# Altium schematic sheet Plata.SchDoc
size 420 x 297 mm; PageSetup: Record=PageOptions|CenterHorizontal=True|CenterVertical=True|PrintScale=0.47|XCorrection=1.00|YCorrection=1.00|PrintKind=1|BorderSize=5000000|LeftOffset=0|BottomOffset=0|Orientation=1|PaperLength=1000|PaperWidth=1000|Scale=100|PaperSource=7|PrintQuality=-4|MediaType=1|DitherType=10|PaperKind=A4|PrintScaleMode=1; MainDevice: Перв.примен.; Scale: 1:1; DocumentType: Схема электрическая принципиальная; FirstReferrence: АБВГ.123456.001
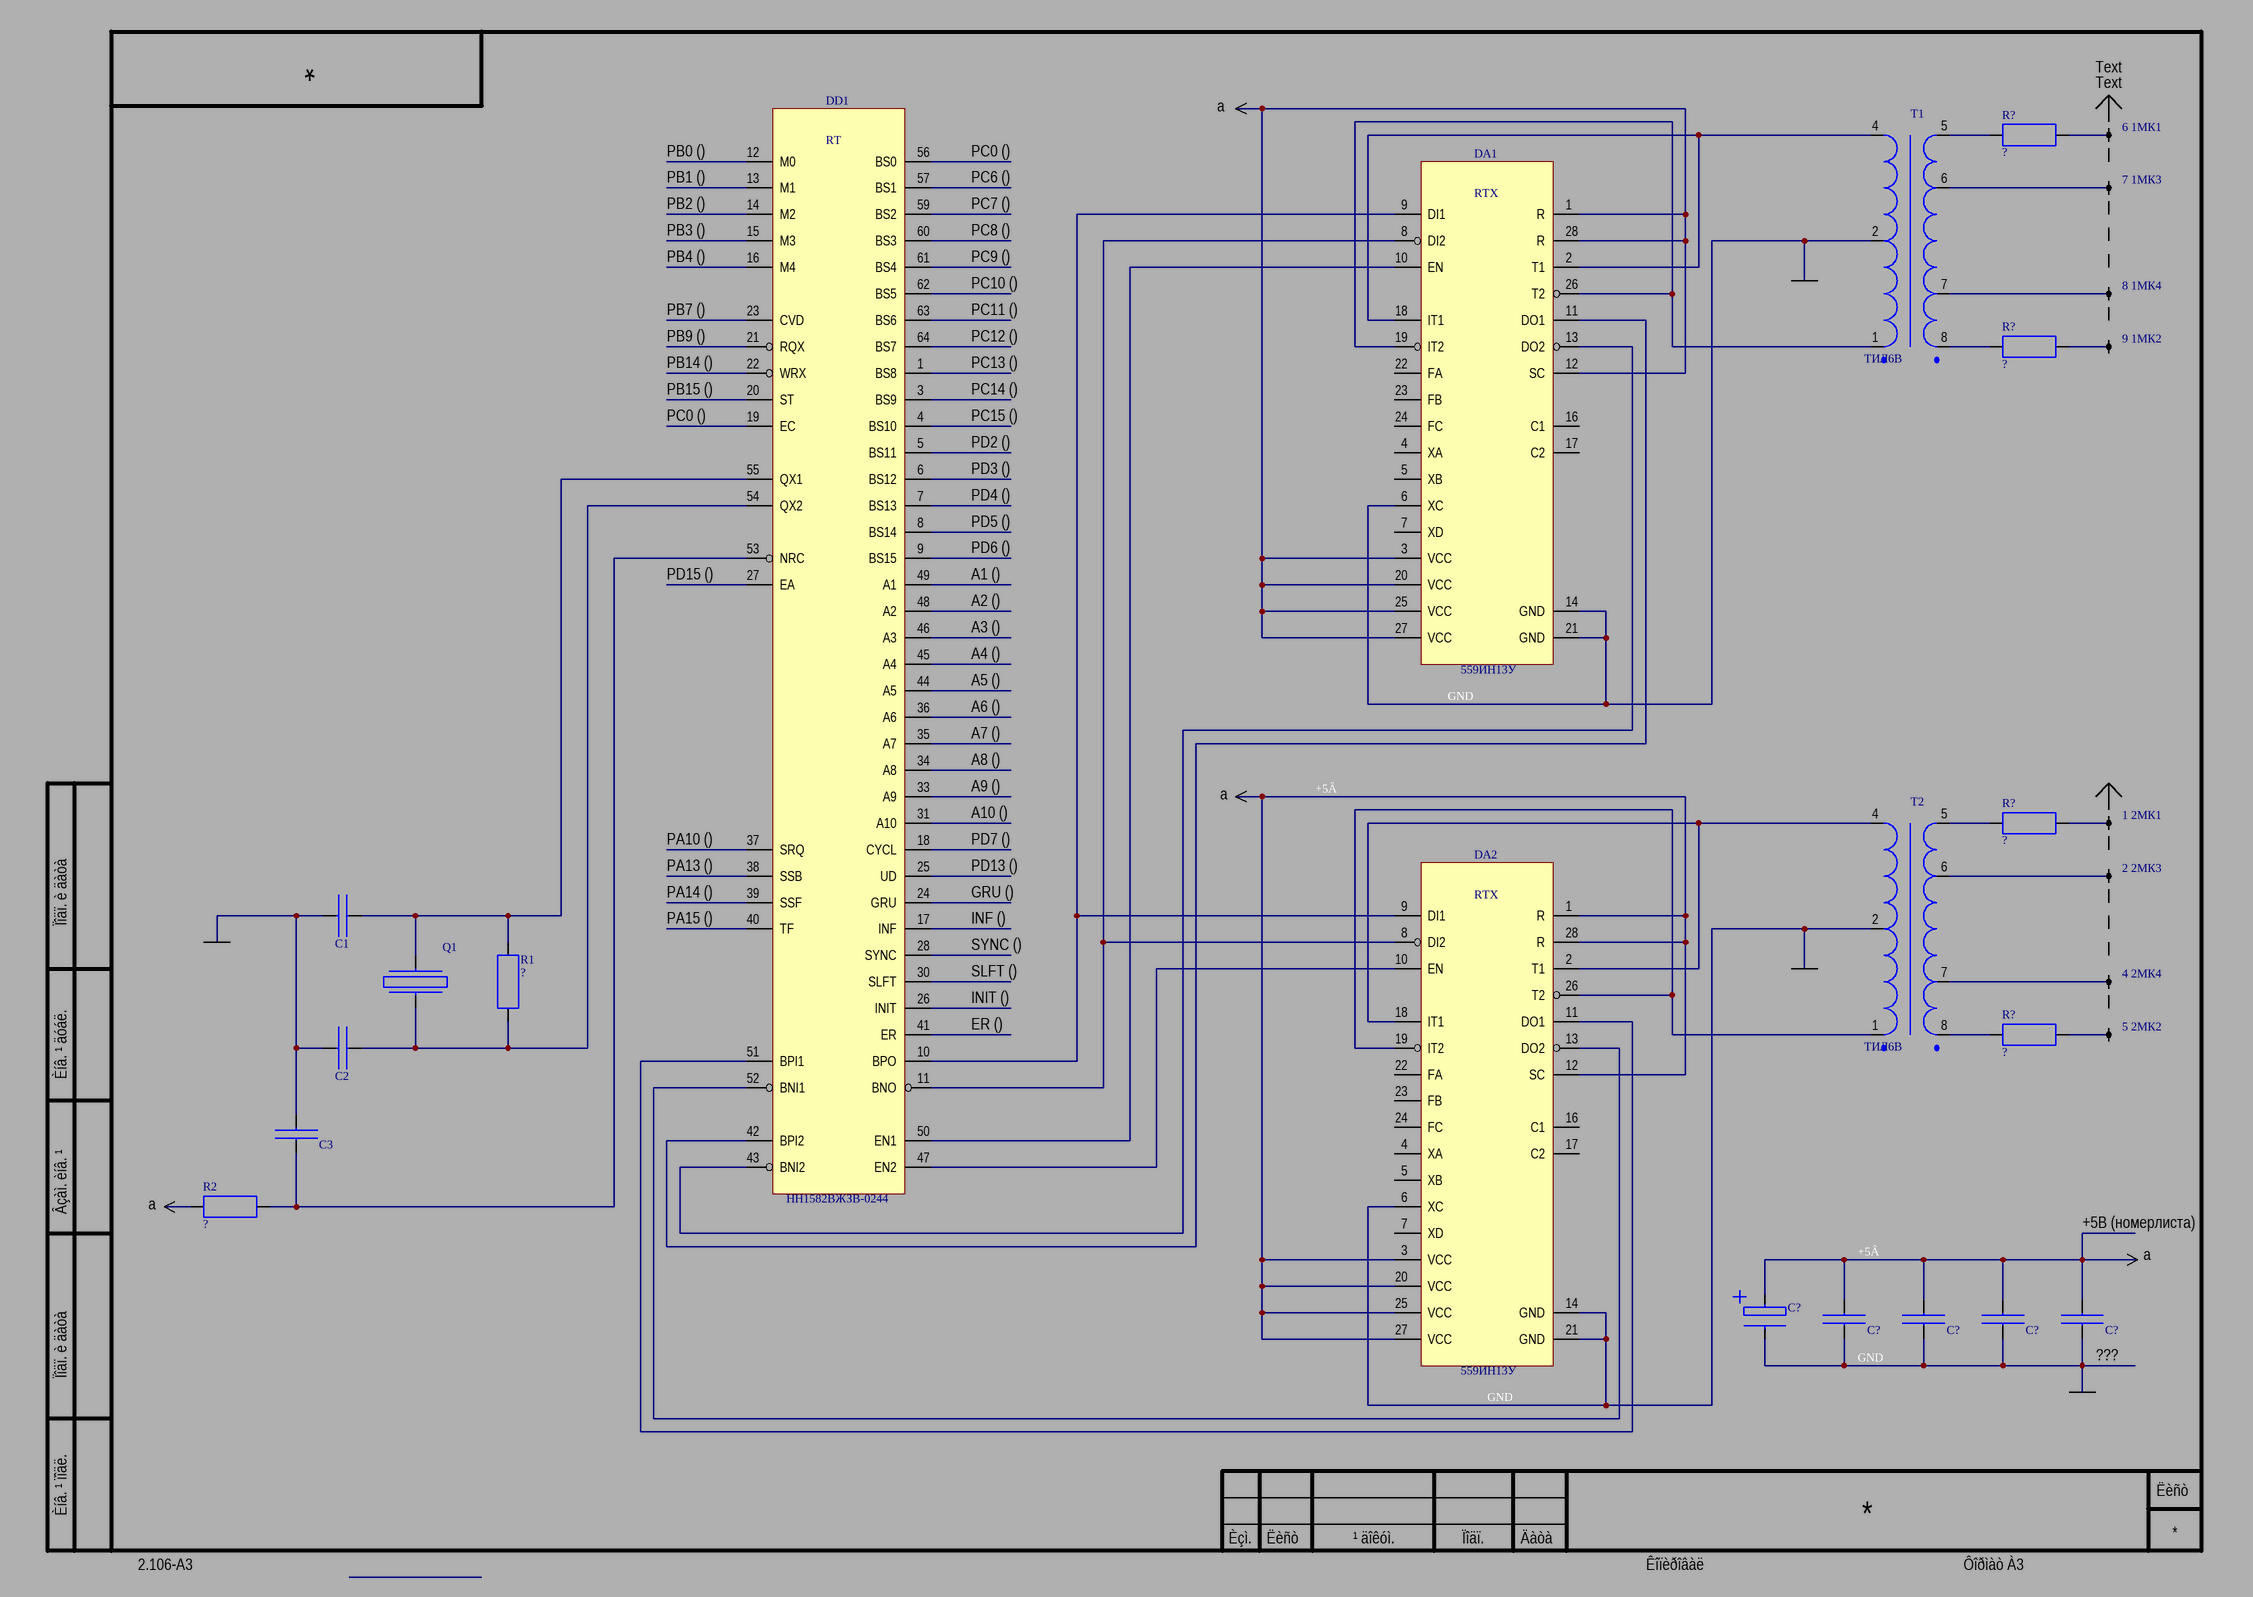
[diagram p0: Plata.SchDoc]

## Parts
(Parts that share a designator on the sheet are numbered #1, #2 ... from top to bottom, then left to right.)
C1  ?  [CAP0805]  (value not drawn)
C2  ?  [CAP0805]  (value not drawn)
C3  ?  [CAP0805]  (value not drawn)
C?#1  C_3  (value not drawn)
C?#2  ?  [CAP0805]  (value not drawn)
C?#3  ?  [CAP0805]  (value not drawn)
C?#4  ?  [CAP0805]  (value not drawn)
C?#5  ?  [CAP0805]  (value not drawn)
DA1  559ИН13У  [H09.28-1B]
DA2  559ИН13У  [H09.28-1B]
DD1  НН1582ВЖЗВ-0244  [H18.64-1B]
Q1  Q_1  (value not drawn)
R1  ?  [RES0805]
R2  ?  [RES0805]
R?#1  ?  [RES0805]
R?#2  ?  [RES0805]
R?#3  ?  [RES0805]
R?#4  ?  [RES0805]
T1  ТИЛ6B  [TIL6V]
T2  ТИЛ6B  [TIL6V]
X?#1  6 1МК1  [PLD10]  (part F of 10)
X?#2  7 1МК3  [PLD10]  (part G of 10)
X?#3  8 1МК4  [PLD10]  (part H of 10)
X?#4  9 1МК2  [PLD10]  (part I of 10)
X?#5  1 2МК1  [PLD10]  (part A of 10)
X?#6  2 2МК3  [PLD10]  (part B of 10)
X?#7  4 2МК4  [PLD10]  (part D of 10)
X?#8  5 2МК2  [PLD10]  (part E of 10)

## Nets
+5Â: C?#1.1 C?#2.2 C?#3.2 C?#4.2 C?#5.2 DA2.1(R) DA2.3(VCC) DA2.12(SC) DA2.20(VCC) DA2.25(VCC) DA2.27(VCC) DA2.28(R)
GND: C?#1.2 C?#2.1 C?#3.1 C?#4.1 C?#5.1 DA1.6(XC) DA1.14(GND) DA1.21(GND) DA2.6(XC) DA2.14(GND) DA2.21(GND) T1.2 T2.2
NetC1_1: C1.1 C2.1 C3.2
NetC1_2: C1.2 DD1.55(QX1) Q1.2 R1.2
NetC2_2: C2.2 DD1.54(QX2) Q1.1 R1.1
NetC3_1: C3.1 DD1.53(NRC) R2.2
NetDA1_1: DA1.1(R) DA1.3(VCC) DA1.12(SC) DA1.20(VCC) DA1.25(VCC) DA1.27(VCC) DA1.28(R)
NetDA1_2: DA1.2(T1) DA1.18(IT1) T1.4
NetDA1_8: DA1.8(DI2) DA2.8(DI2) DD1.11(BNO)
NetDA1_9: DA1.9(DI1) DA2.9(DI1) DD1.10(BPO)
NetDA1_10: DA1.10(EN) DD1.50(EN1)
NetDA1_11: DA1.11(DO1) DD1.42(BPI2)
NetDA1_13: DA1.13(DO2) DD1.43(BNI2)
NetDA1_19: DA1.19(IT2) DA1.26(T2) T1.1
NetDA2_2: DA2.2(T1) DA2.18(IT1) T2.4
NetDA2_10: DA2.10(EN) DD1.47(EN2)
NetDA2_11: DA2.11(DO1) DD1.51(BPI1)
NetDA2_13: DA2.13(DO2) DD1.52(BNI1)
NetDA2_19: DA2.19(IT2) DA2.26(T2) T2.1
NetR?#1_1: R?#1.1 T1.5
NetR?#1_2: R?#1.2 X?#1.6
NetR?#2_1: R?#2.1 T1.8
NetR?#2_2: R?#2.2 X?#4.9
NetR?#3_1: R?#3.1 T2.5
NetR?#3_2: R?#3.2 X?#5.1
NetR?#4_1: R?#4.1 T2.8
NetR?#4_2: R?#4.2 X?#8.5
NetT1_6: T1.6 X?#2.7
NetT1_7: T1.7 X?#3.8
NetT2_6: T2.6 X?#6.2
NetT2_7: T2.7 X?#7.4

Not connected (* = marked no-connect by the designer): DA1 4(XA) 5(XB) 7(XD) 16(C1) 17(C2) 22(FA) 23(FB) 24(FC); DA2 4(XA) 5(XB) 7(XD) 16(C1) 17(C2) 22(FA) 23(FB) 24(FC); DD1 1(BS8) 3(BS9) 4(BS10) 5(BS11) 6(BS12) 7(BS13) 8(BS14) 9(BS15) 12(M0) 13(M1) 14(M2) 15(M3) 16(M4) 17(INF) 18(CYCL) 19(EC) 20(ST) 21(RQX) 22(WRX) 23(CVD) 24(GRU) 25(UD) 26(INIT) 27(EA) 28(SYNC) 30(SLFT) 31(A10) 33(A9) 34(A8) 35(A7) 36(A6) 37(SRQ) 38(SSB) 39(SSF) 40(TF) 41(ER) 44(A5) 45(A4) 46(A3) 48(A2) 49(A1) 56(BS0) 57(BS1) 59(BS2) 60(BS3) 61(BS4) 62(BS5) 63(BS6) 64(BS7); R2 1

## Notes on the sheet
- Text
- a
- PB1 ()
- PB0 ()
- PC0 ()
- PC6 ()
- PB2 ()
- PB3 ()
- PC7 ()
- PC8 ()
- PB7 ()
- PB4 ()
- PC9 ()
- PC10 ()
- PC11 ()
- PB9 ()
- (near DD1) PB14 ()
- (near DD1) PB15 ()
- PC12 ()
- PC13 ()
- PC14 ()
- PC15 ()
- PD2 ()
- PD3 ()
- PD4 ()
- PD5 ()
- (near DD1) PD15 ()
- A1 ()
- PD6 ()
- A2 ()
- A3 ()
- A4 ()
- A5 ()
- A6 ()
- A7 ()
- A8 ()
- A9 ()
- (near DD1) PA10 ()
- A10 ()
- PD7 ()
- (near DD1) PA13 ()
- (near DD1) PA14 ()
- (near DD1) PA15 ()
- PD13 ()
- GRU ()
- INF ()
- SYNC ()
- SLFT ()
- INIT ()
- ER ()
- (near R2) a
- +5В (номерлиста)
- (near C?#5) ???
- Ïîäï. è äàòà
- Èíâ. ¹ äóáë.
- Âçàì. èíâ. ¹
- Èíâ. ¹ ïîäë.
- Èçì.
- Ëèñò
- ¹ äîêóì.
- Ïîäï.
- Äàòà
- 2.106-A3
- Êîïèðîâàë
- Ôîðìàò À3
- (in symbol 559ИН13У) RTX
- (in symbol НН1582ВЖЗВ-0244) RT

## Library data of the parts
C1-C3 C?#2-C?#5 = C_2
R1 R2 R?#1-R?#4 = R_1
X?#1-X?#8 = PLD10